# Altium schematic sheet 03_Mechanicals.SchDoc
size A; ApprovedDate: 04/02/2019; AssemblyNumber: ECE315-F19
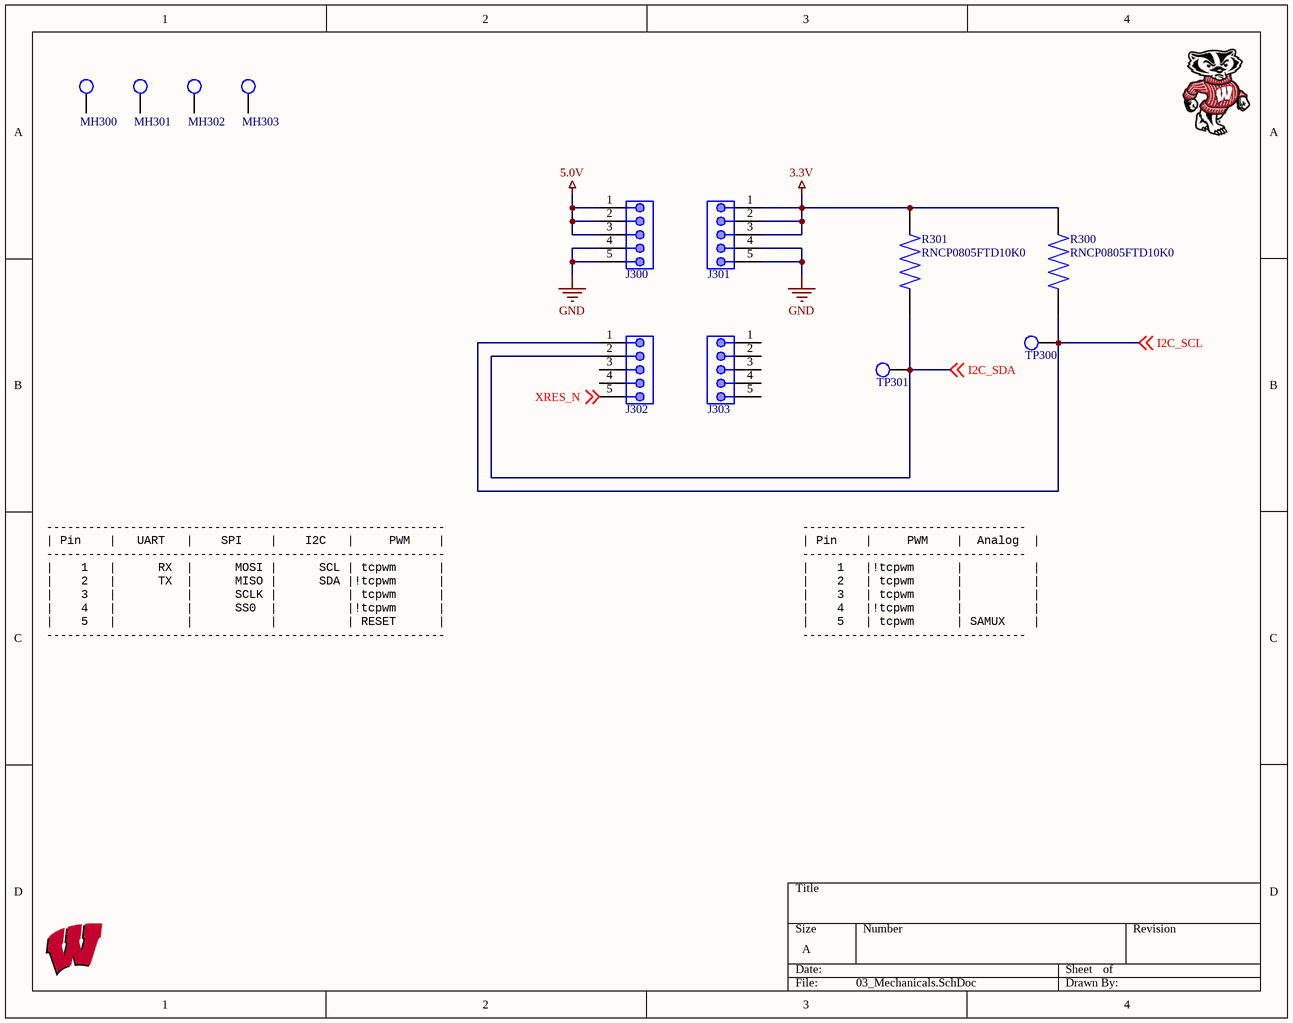
[diagram p0: 03_Mechanicals.SchDoc]

## Parts
J300  CONN_HEADER_MALE_1x5  [HDR1X5]  (value not drawn)
J301  CONN_HEADER_MALE_1x5  [HDR1X5]  (value not drawn)
J302  CONN_HEADER_MALE_1x5  [HDR1X5]  (value not drawn)
J303  CONN_HEADER_MALE_1x5  [HDR1X5]  (value not drawn)
MH300  MHOLE_2_55MM  [MHOLE_2_55MM]  (value not drawn)  (no BOM)
MH301  MHOLE_2_55MM  [MHOLE_2_55MM]  (value not drawn)  (no BOM)
MH302  MHOLE_2_55MM  [MHOLE_2_55MM]  (value not drawn)  (no BOM)
MH303  MHOLE_2_55MM  [MHOLE_2_55MM]  (value not drawn)  (no BOM)
R300  RNCP0805FTD10K0  [RESC2012X60N]
R301  RNCP0805FTD10K0  [RESC2012X60N]
TP300  TP_1206  [TP-SMC-1206]  (value not drawn)
TP301  TP_1206  [TP-SMC-1206]  (value not drawn)

## Nets
3.3V: J301.1 J301.2 J301.3 R300.2 R301.2
5.0V: J300.1 J300.2 J300.3
GND: J300.4 J300.5 J301.4 J301.5
I2C_SCL: J302.1 R300.1 TP300.1 ; off-sheet I2C_SCL
I2C_SDA: J302.2 R301.1 TP301.1 ; off-sheet I2C_SDA
XRES_N: J302.5 ; off-sheet XRES_N

Not connected (* = marked no-connect by the designer): J302 3 4; J303 1 2 3 4 5; MH300 1; MH301 1; MH302 1; MH303 1

## Notes on the sheet
- ---------------------------------------------------------
  | Pin    |   UART   |    SPI    |    I2C   |     PWM    |
  ---------------------------------------------------------
  |    1   |      RX  |      MOSI |      SCL | tcpwm      |
  |    2   |      TX  |      MISO |      SDA |!tcpwm      |
  |    3   |          |      SCLK |          | tcpwm      |
  |    4   |          |      SS0  |          |!tcpwm      |
  |    5   |          |           |          | RESET      |
  ---------------------------------------------------------
- --------------------------------
  | Pin    |     PWM    |  Analog  |
  --------------------------------
  |    1   |!tcpwm      |          |
  |    2   | tcpwm      |          |
  |    3   | tcpwm      |          |
  |    4   |!tcpwm      |          |
  |    5   | tcpwm      | SAMUX    |
  --------------------------------

## Library data of the parts
J300-J303 = CONN_HEADER_MALE_1x5: Header, 5-Pin; Manufacturer 1: Sullins; Manufacturer Part Number 1: PREC005SACN-RC; Number of Positions: 5; Connector Type: Male Pin; Pitch: 0.1inch; ComponentLink1URL: http://www.farnell.com/cad/1737268.pdf; ComponentLink1Description: http://www.farnell.com/cad/1737268.pdf; ComponentLink2URL: http://katalog.we-online.de/em/datasheet/6130xx11121.pdf; ComponentLink2Description: http://katalog.we-online.de/em/datasheet/6130xx11121.pdf; Supplier 1: Digi-Key; Stock 1: 0; Pricing 1: 1=0.19000, 10=0.17400, 25=0.12960, 50=0.11120, 100=0.10740, 250=0.09264, 500=0.08892 (USD); RoHS: Yes; Mount: Through Hole; Color: Black; Contact Plating: Tin; Package Quantity: 1; Number of Rows: 1; Packaging: Bulk; Termination: Solder; Contact Mating Length: 0.23inch; ComponentLink3URL: https://datasheet.ciiva.com/741/xrxczzzsxxn-rc-st-11635-b-741840.pdf?src-supplier=Digi-Key; ComponentLink3Description: https://datasheet.ciiva.com/741/xrxczzzsxxn-rc-st-11635-b-741840.pdf?src-supplier=Digi-Key; Supplier Part Number 1: S1032EC-05-ND
MH300-MH303 = MHOLE_2_55MM: Mounting Holde; Manufacturer Part Number: UW MTHOLE
R300 R301 = RNCP0805FTD10K0: 10 kOhms Â±1% 0.25W, 1/4W Chip Resistor 0805 _2012 Metric_ Anti-Sulfur, Moisture Resistant Thin Film; MF: Stackpole Electronics Inc; SnapEDA_Link: https://www.snapeda.com/parts/RNCP0805FTD10K0/Stackpole%20Electronics%20Inc/view-part/3229162/?ref=snap; Digi-Key_Purchase_URL: https://www.digikey.com/product-detail/en/stackpole-electronics-inc/RNCP0805FTD10K0/RNCP0805FTD10K0CT-ND/2240601?utm_source=snapeda&utm_medium=aggregator&utm_campaign=symbol; MP: RNCP0805FTD10K0; Digi-Key_Part_Number: RNCP0805FTD10K0CT-ND; Value: *; Package: 2012 Stackpole
TP300 TP301 = TP_1206: Test Point SMD 1206; Manufacturer: TE Connectivity (Tyco Electronics); Manufacturer Part Number: 1625854-1; Resistance Value: 0 Ohm; Temperature Coefficient: N/R; Supplier: Digi-Key; Stock 1: 31937; Pricing 1: 1=0.28, 10=0.261, 25=0.224, 50=0.1902, 100=0.1828, 250=0.1641, 500=0.1567, 1000=0.1306 (USD); Case Size: 1206; Dimension: 3.2 x 1.6 x 1.25mm; Family: RC; Mounting: Surface Mount; Operating Temperature: -55 to 125 C; Part No: 1625854-1; RoHS: Yes; Packaging: Tape and Reel; Termination Style: N/R; Terminal Pitch: N/R; Power Rating: N/R; Tolerance: N/R; ComponentLink1URL: https://datasheet.ciiva.com/6439/eng-ds-1773266-a-6439169.pdf; ComponentLink1Description: https://datasheet.ciiva.com/6439/eng-ds-1773266-a-6439169.pdf; ComponentLink2URL: https://datasheet.ciiva.com/30136/1773266-a-30136341.pdf; ComponentLink2Description: https://datasheet.ciiva.com/30136/1773266-a-30136341.pdf; ComponentLink3URL: https://datasheet.ciiva.com/6439/eng-ds-1773266-a-6439080.pdf; ComponentLink3Description: https://datasheet.ciiva.com/6439/eng-ds-1773266-a-6439080.pdf; ComponentLink4URL: https://datasheet.ciiva.com/6439/eng-ds-1773266-a-6439081.pdf; ComponentLink4Description: https://datasheet.ciiva.com/6439/eng-ds-1773266-a-6439081.pdf; ComponentLink5URL: https://datasheet.ciiva.com/6439/eng-ds-1773266-a-6439083.pdf; ComponentLink5Description: https://datasheet.ciiva.com/6439/eng-ds-1773266-a-6439083.pdf; Supplier Part Number: A106143CT-ND